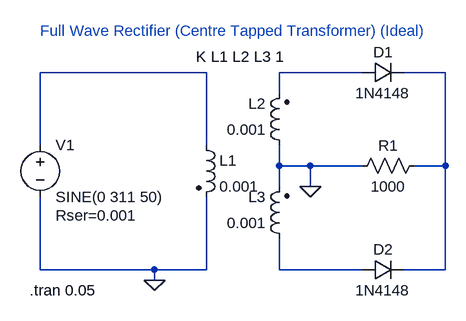
[diagram p0: schematic Assignment 4a (ii).asc]
Assignment 4a (ii).asc, the LTspice schematic file:
Version 4.1
SHEET 1 880 680
WIRE 128 16 -128 16
WIRE 368 16 240 16
WIRE 496 16 432 16
WIRE 240 48 240 16
WIRE -128 128 -128 16
WIRE 128 128 128 16
WIRE 240 160 240 128
WIRE 288 160 240 160
WIRE 368 160 288 160
WIRE 496 160 496 16
WIRE 496 160 448 160
WIRE 240 192 240 160
WIRE 288 192 288 160
WIRE -128 320 -128 208
WIRE 48 320 -128 320
WIRE 128 320 128 208
WIRE 128 320 48 320
WIRE 240 320 240 272
WIRE 368 320 240 320
WIRE 496 320 496 160
WIRE 496 320 432 320
WIRE 48 336 48 320
FLAG 288 192 0
FLAG 48 336 0
SYMBOL voltage -128 112 R0
WINDOW 123 0 0 Left 2
WINDOW 39 24 124 Left 2
SYMATTR SpiceLine Rser=0.001
SYMATTR InstName V1
SYMATTR Value SINE(0 311 50)
SYMBOL ind2 112 112 R0
SYMATTR InstName L1
SYMATTR Value 0.001
SYMATTR Type ind
SYMBOL ind2 256 144 R180
WINDOW 0 36 80 Left 2
WINDOW 3 36 40 Left 2
SYMATTR InstName L2
SYMATTR Value 0.001
SYMATTR Type ind
SYMBOL ind2 256 288 R180
WINDOW 0 36 80 Left 2
WINDOW 3 36 40 Left 2
SYMATTR InstName L3
SYMATTR Value 0.001
SYMATTR Type ind
SYMBOL diode 368 32 R270
WINDOW 0 32 32 VTop 2
WINDOW 3 0 32 VBottom 2
SYMATTR InstName D1
SYMATTR Value 1N4148
SYMBOL diode 368 336 R270
WINDOW 0 32 32 VTop 2
WINDOW 3 0 32 VBottom 2
SYMATTR InstName D2
SYMATTR Value 1N4148
SYMBOL res 464 144 R90
WINDOW 0 0 56 VBottom 2
WINDOW 3 32 56 VTop 2
SYMATTR InstName R1
SYMATTR Value 1000
TEXT -128 -48 Left 2 ;Full Wave Rectifier (Centre Tapped Transformer) (Ideal)
TEXT 112 -8 Left 2 !K L1 L2 L3 1
TEXT -144 352 Left 2 !.tran 0.05

The netlist it stands for:
* Assignment 4a (ii).asc
V1 N001 0 SINE(0 311 50) Rser=0.001
L1 N001 0 0.001
L2 0 N002 0.001
L3 N004 0 0.001
D1 N002 N003 1N4148
D2 N004 N003 1N4148
R1 N003 0 1000
.model D D
.lib standard.dio
* Full Wave Rectifier (Centre Tapped Transformer) (Ideal)
K L1 L2 L3 1
.tran 0.05
.backanno
.end